# Altium schematic sheet Brushed_Motor_MCU.SchDoc
size A3; SheetNumber: 8; SheetTotal: 8
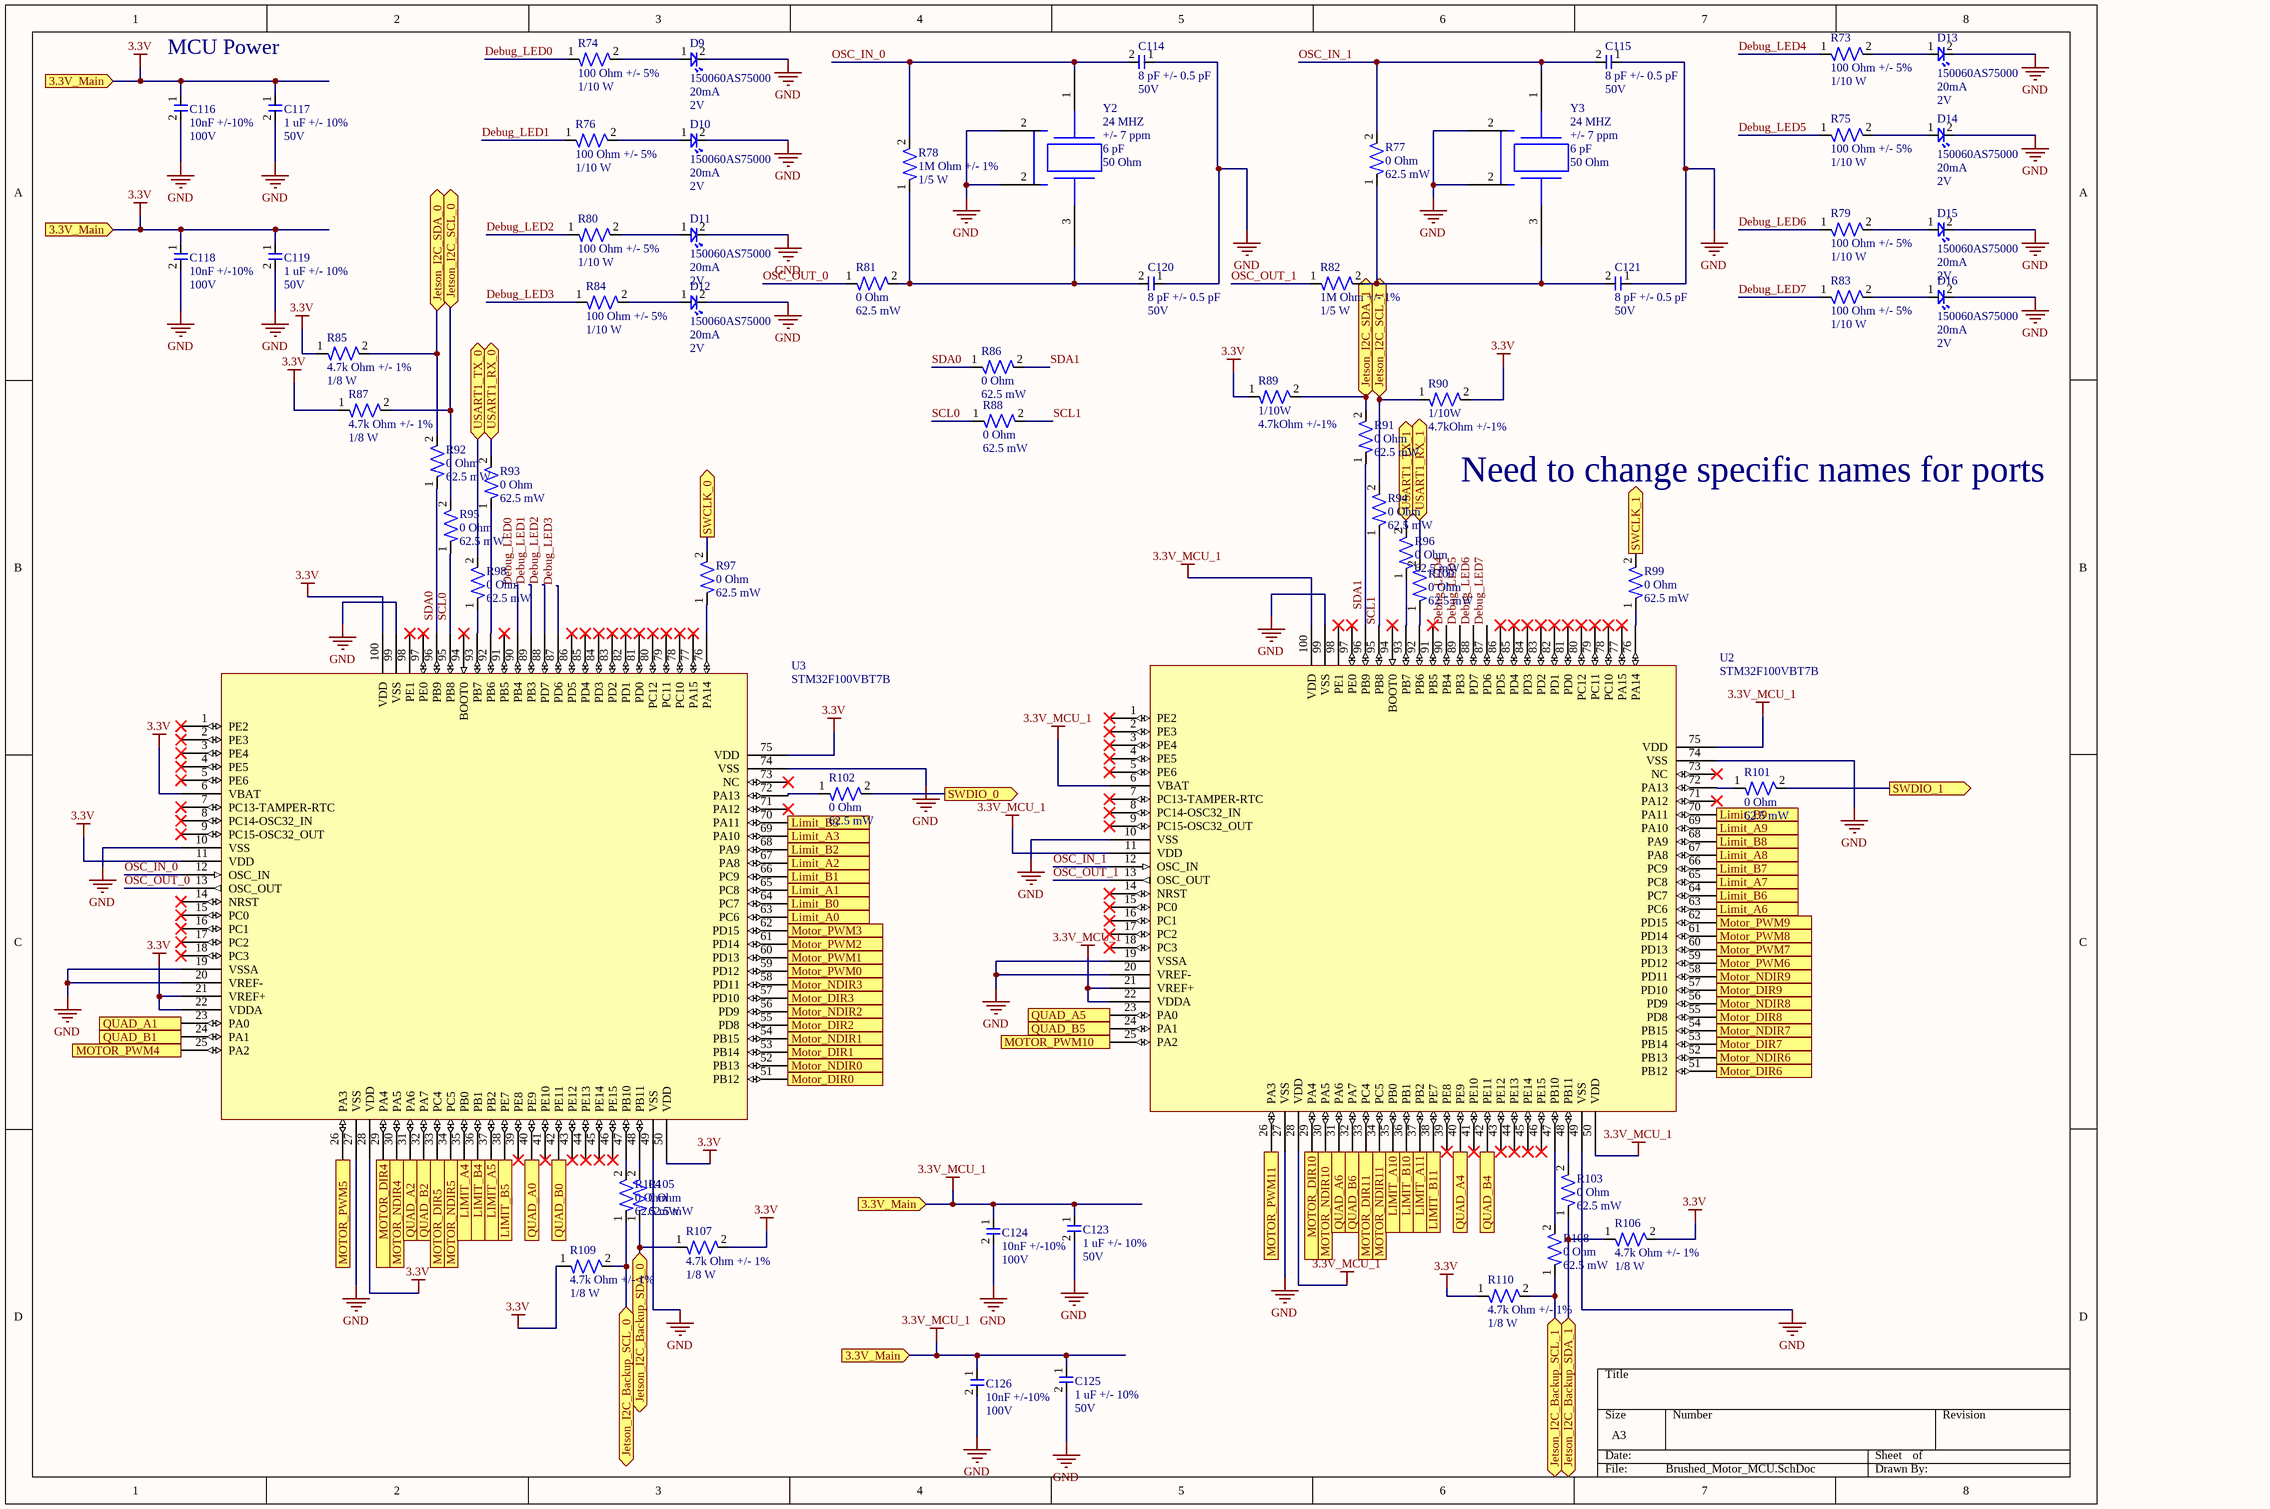
[diagram p0: Brushed_Motor_MCU.SchDoc]

## Parts
C114  Capaitance: 8 pF +/- 0.5 pF  Parameter 2: 50V  [CAP-0402]  (hidden comment: CC0402DRNPO9BN8R0)
C115  Capaitance: 8 pF +/- 0.5 pF  Parameter 2: 50V  [CAP-0402]  (hidden comment: CC0402DRNPO9BN8R0)
C116  Capacitance: 10nF +/-10%  Voltage Rating: 100V  [CAP-0603]  (hidden comment: CC0603KRX7R0BB103)
C117  Cap: 1 uF +/- 10%  Voltage: 50V  [CAP-0805]  (hidden comment: GCM21BR71H105KA03L)
C118  Capacitance: 10nF +/-10%  Voltage Rating: 100V  [CAP-0603]  (hidden comment: CC0603KRX7R0BB103)
C119  Cap: 1 uF +/- 10%  Voltage: 50V  [CAP-0805]  (hidden comment: GCM21BR71H105KA03L)
C120  Capaitance: 8 pF +/- 0.5 pF  Parameter 2: 50V  [CAP-0402]  (hidden comment: CC0402DRNPO9BN8R0)
C121  Capaitance: 8 pF +/- 0.5 pF  Parameter 2: 50V  [CAP-0402]  (hidden comment: CC0402DRNPO9BN8R0)
C123  Cap: 1 uF +/- 10%  Voltage: 50V  [CAP-0805]  (hidden comment: GCM21BR71H105KA03L)
C124  Capacitance: 10nF +/-10%  Voltage Rating: 100V  [CAP-0603]  (hidden comment: CC0603KRX7R0BB103)
C125  Cap: 1 uF +/- 10%  Voltage: 50V  [CAP-0805]  (hidden comment: GCM21BR71H105KA03L)
C126  Capacitance: 10nF +/-10%  Voltage Rating: 100V  [CAP-0603]  (hidden comment: CC0603KRX7R0BB103)
D9  150060AS75000  Current Rating: 20mA  Vf: 2V  [LED-0603]
D10  150060AS75000  Current Rating: 20mA  Vf: 2V  [LED-0603]
D11  150060AS75000  Current Rating: 20mA  Vf: 2V  [LED-0603]
D12  150060AS75000  Current Rating: 20mA  Vf: 2V  [LED-0603]
D13  150060AS75000  Current Rating: 20mA  Vf: 2V  [LED-0603]
D14  150060AS75000  Current Rating: 20mA  Vf: 2V  [LED-0603]
D15  150060AS75000  Current Rating: 20mA  Vf: 2V  [LED-0603]
D16  150060AS75000  Current Rating: 20mA  Vf: 2V  [LED-0603]
R73  Resistance: 100 Ohm +/- 5%  Power: 1/10 W  [RES-0402]  (hidden comment: ERJ2GEJ101X)
R74  Resistance: 100 Ohm +/- 5%  Power: 1/10 W  [RES-0402]  (hidden comment: ERJ2GEJ101X)
R75  Resistance: 100 Ohm +/- 5%  Power: 1/10 W  [RES-0402]  (hidden comment: ERJ2GEJ101X)
R76  Resistance: 100 Ohm +/- 5%  Power: 1/10 W  [RES-0402]  (hidden comment: ERJ2GEJ101X)
R77  Resistance: 0 Ohm  Power: 62.5 mW  [RES-0402]  (hidden comment: RC0402FR-070RL)
R78  Resistance: 1M Ohm +/- 1%  Power: 1/5 W  [RES-0402]  (hidden comment: ERJPA2F1004X)
R79  Resistance: 100 Ohm +/- 5%  Power: 1/10 W  [RES-0402]  (hidden comment: ERJ2GEJ101X)
R80  Resistance: 100 Ohm +/- 5%  Power: 1/10 W  [RES-0402]  (hidden comment: ERJ2GEJ101X)
R81  Resistance: 0 Ohm  Power: 62.5 mW  [RES-0402]  (hidden comment: RC0402FR-070RL)
R82  Resistance: 1M Ohm +/- 1%  Power: 1/5 W  [RES-0402]  (hidden comment: ERJPA2F1004X)
R83  Resistance: 100 Ohm +/- 5%  Power: 1/10 W  [RES-0402]  (hidden comment: ERJ2GEJ101X)
R84  Resistance: 100 Ohm +/- 5%  Power: 1/10 W  [RES-0402]  (hidden comment: ERJ2GEJ101X)
R85  Resistance: 4.7k Ohm +/- 1%  Power: 1/8 W  [RES-0402]  (hidden comment: RC0402FR-7W4K7L)
R86  Resistance: 0 Ohm  Power: 62.5 mW  [RES-0402]  (hidden comment: RC0402FR-070RL)
R87  Resistance: 4.7k Ohm +/- 1%  Power: 1/8 W  [RES-0402]  (hidden comment: RC0402FR-7W4K7L)
R88  Resistance: 0 Ohm  Power: 62.5 mW  [RES-0402]  (hidden comment: RC0402FR-070RL)
R89  Power Rating: 1/10W  Resistance: 4.7kOhm +/-1%  [RES-0603]  (hidden comment: AF0603FR-074K7L)
R90  Power Rating: 1/10W  Resistance: 4.7kOhm +/-1%  [RES-0603]  (hidden comment: AF0603FR-074K7L)
R91  Resistance: 0 Ohm  Power: 62.5 mW  [RES-0402]  (hidden comment: RC0402FR-070RL)
R92  Resistance: 0 Ohm  Power: 62.5 mW  [RES-0402]  (hidden comment: RC0402FR-070RL)
R93  Resistance: 0 Ohm  Power: 62.5 mW  [RES-0402]  (hidden comment: RC0402FR-070RL)
R94  Resistance: 0 Ohm  Power: 62.5 mW  [RES-0402]  (hidden comment: RC0402FR-070RL)
R95  Resistance: 0 Ohm  Power: 62.5 mW  [RES-0402]  (hidden comment: RC0402FR-070RL)
R96  Resistance: 0 Ohm  Power: 62.5 mW  [RES-0402]  (hidden comment: RC0402FR-070RL)
R97  Resistance: 0 Ohm  Power: 62.5 mW  [RES-0402]  (hidden comment: RC0402FR-070RL)
R98  Resistance: 0 Ohm  Power: 62.5 mW  [RES-0402]  (hidden comment: RC0402FR-070RL)
R99  Resistance: 0 Ohm  Power: 62.5 mW  [RES-0402]  (hidden comment: RC0402FR-070RL)
R100  Resistance: 0 Ohm  Power: 62.5 mW  [RES-0402]  (hidden comment: RC0402FR-070RL)
R101  Resistance: 0 Ohm  Power: 62.5 mW  [RES-0402]  (hidden comment: RC0402FR-070RL)
R102  Resistance: 0 Ohm  Power: 62.5 mW  [RES-0402]  (hidden comment: RC0402FR-070RL)
R103  Resistance: 0 Ohm  Power: 62.5 mW  [RES-0402]  (hidden comment: RC0402FR-070RL)
R104  Resistance: 0 Ohm  Power: 62.5 mW  [RES-0402]  (hidden comment: RC0402FR-070RL)
R105  Resistance: 0 Ohm  Power: 62.5 mW  [RES-0402]  (hidden comment: RC0402FR-070RL)
R106  Resistance: 4.7k Ohm +/- 1%  Power: 1/8 W  [RES-0402]  (hidden comment: RC0402FR-7W4K7L)
R107  Resistance: 4.7k Ohm +/- 1%  Power: 1/8 W  [RES-0402]  (hidden comment: RC0402FR-7W4K7L)
R108  Resistance: 0 Ohm  Power: 62.5 mW  [RES-0402]  (hidden comment: RC0402FR-070RL)
R109  Resistance: 4.7k Ohm +/- 1%  Power: 1/8 W  [RES-0402]  (hidden comment: RC0402FR-7W4K7L)
R110  Resistance: 4.7k Ohm +/- 1%  Power: 1/8 W  [RES-0402]  (hidden comment: RC0402FR-7W4K7L)
U2  STM32F100VBT7B  [IC-STM32F100-0001]
U3  STM32F100VBT7B  [IC-STM32F100-0001]
Y2  Frequency: 24 MHZ  Frequency Tolerance: +/- 7 ppm  Load Capacitance: 6 pF  Equavalence Series Resistance: 50 Ohm  [CRYSTAL-4-SMD-0001]  (hidden comment: ECS-240-6-37B-7KM-TR)
Y3  Frequency: 24 MHZ  Frequency Tolerance: +/- 7 ppm  Load Capacitance: 6 pF  Equavalence Series Resistance: 50 Ohm  [CRYSTAL-4-SMD-0001]  (hidden comment: ECS-240-6-37B-7KM-TR)

## Ports
3.3V_Main (in), Jetson_I2C_Backup_SCL_0 (bidir), Jetson_I2C_Backup_SCL_1 (bidir), Jetson_I2C_Backup_SDA_0 (bidir), Jetson_I2C_Backup_SDA_1 (bidir), Jetson_I2C_SCL_0 (bidir), Jetson_I2C_SCL_1 (bidir), Jetson_I2C_SDA_0 (bidir), Jetson_I2C_SDA_1 (bidir), Limit_A0 (out), Limit_A1 (out), Limit_A2 (out), Limit_A3 (out), LIMIT_A4 (out), LIMIT_A5 (out), Limit_A6 (out), Limit_A7 (out), Limit_A8 (out), Limit_A9 (out), LIMIT_A10 (out), LIMIT_A11 (out), Limit_B0 (out), Limit_B1 (out), Limit_B2 (out), Limit_B3 (out), LIMIT_B4 (out), LIMIT_B5 (out), Limit_B6 (out), Limit_B7 (out), Limit_B8 (out), Limit_B9 (out), LIMIT_B10 (out), LIMIT_B11 (out), Motor_DIR0 (out), Motor_DIR1 (out), Motor_DIR2 (out), Motor_DIR3 (out), MOTOR_DIR4 (out), MOTOR_DIR5 (out), Motor_DIR6 (out), Motor_DIR7 (out), Motor_DIR8 (out), Motor_DIR9 (out), MOTOR_DIR10 (out), MOTOR_DIR11 (out), Motor_NDIR0 (out), Motor_NDIR1 (out), Motor_NDIR2 (out), Motor_NDIR3 (out), MOTOR_NDIR4 (out), MOTOR_NDIR5 (out), Motor_NDIR6 (out), Motor_NDIR7 (out), Motor_NDIR8 (out), Motor_NDIR9 (out), MOTOR_NDIR10 (out), MOTOR_NDIR11 (out), Motor_PWM0 (out), Motor_PWM1 (out), Motor_PWM2 (out), Motor_PWM3 (out), MOTOR_PWM4 (out), MOTOR_PWM5 (out), Motor_PWM6 (out), Motor_PWM7 (out), Motor_PWM8 (out), Motor_PWM9 (out), MOTOR_PWM10 (out), MOTOR_PWM11 (out), QUAD_A0 (out), QUAD_A1 (out), QUAD_A2 (out), QUAD_A4 (out), QUAD_A5 (out), QUAD_A6 (out), QUAD_B0 (out), QUAD_B1 (out), QUAD_B2 (out), QUAD_B4 (out), QUAD_B5 (out), QUAD_B6 (out), SWCLK_0 (out), SWCLK_1 (out), SWDIO_0 (out), SWDIO_1 (out), USART1_RX_0 (bidir), USART1_RX_1 (bidir), USART1_TX_0 (bidir), USART1_TX_1 (bidir)

## Nets
3.3V: C116.1 C117.1 C118.1 C119.1 C123.1 C124.1 C125.1 C126.1 R85.1 R87.1 R89.1 R90.2 R106.2 R107.2 R109.1 R110.1 U2.6(VBAT) U2.11(VDD) U2.21(VREF+) U2.22(VDDA) U2.28(VDD) U2.50(VDD) U2.75(VDD) U2.100(VDD) U3.6(VBAT) U3.11(VDD) U3.21(VREF+) U3.22(VDDA) U3.28(VDD) U3.50(VDD) U3.75(VDD) U3.100(VDD) ; port 3.3V_Main  [also labelled 3.3V_MCU_1]
GND: C114.1 C115.1 C116.2 C117.2 C118.2 C119.2 C120.1 C121.1 C123.2 C124.2 C125.2 C126.2 D9.2 D10.2 D11.2 D12.2 D13.2 D14.2 D15.2 D16.2 U2.10(VSS) U2.19(VSSA) U2.20(VREF-) U2.27(VSS) U2.49(VSS) U2.74(VSS) U2.99(VSS) U3.10(VSS) U3.19(VSSA) U3.20(VREF-) U3.27(VSS) U3.49(VSS) U3.74(VSS) U3.99(VSS) Y2.2 Y3.2
Debug_LED0: R74.1 U3.90(PB4)
Debug_LED1: R76.1 U3.89(PB3)
Debug_LED2: R80.1 U3.88(PD7)
Debug_LED3: R84.1 U3.87(PD6)
Debug_LED4: R73.1 U2.90(PB4)
Debug_LED5: R75.1 U2.89(PB3)
Debug_LED6: R79.1 U2.88(PD7)
Debug_LED7: R83.1 U2.87(PD6)
Jetson_I2C_Backup_SCL_0: R104.1 R109.2 ; port Jetson_I2C_Backup_SCL_0
Jetson_I2C_Backup_SCL_1: R108.1 R110.2 ; port Jetson_I2C_Backup_SCL_1
Jetson_I2C_Backup_SDA_0: R105.1 R107.1 ; port Jetson_I2C_Backup_SDA_0
Jetson_I2C_Backup_SDA_1: R103.1 R106.1 ; port Jetson_I2C_Backup_SDA_1
Jetson_I2C_SCL_0: R87.2 R95.2 ; port Jetson_I2C_SCL_0
Jetson_I2C_SCL_1: R90.1 R94.2 ; port Jetson_I2C_SCL_1
Jetson_I2C_SDA_0: R85.2 R92.2 ; port Jetson_I2C_SDA_0
Jetson_I2C_SDA_1: R89.2 R91.2 ; port Jetson_I2C_SDA_1
Limit_A0: U3.63(PC6) ; port Limit_A0
Limit_A1: U3.65(PC8) ; port Limit_A1
Limit_A2: U3.67(PA8) ; port Limit_A2
Limit_A3: U3.69(PA10) ; port Limit_A3
LIMIT_A4: U3.35(PB0) ; port LIMIT_A4
LIMIT_A5: U3.37(PB2) ; port LIMIT_A5
Limit_A6: U2.63(PC6) ; port Limit_A6
Limit_A7: U2.65(PC8) ; port Limit_A7
Limit_A8: U2.67(PA8) ; port Limit_A8
Limit_A9: U2.69(PA10) ; port Limit_A9
LIMIT_A10: U2.35(PB0) ; port LIMIT_A10
LIMIT_A11: U2.37(PB2) ; port LIMIT_A11
Limit_B0: U3.64(PC7) ; port Limit_B0
Limit_B1: U3.66(PC9) ; port Limit_B1
Limit_B2: U3.68(PA9) ; port Limit_B2
Limit_B3: U3.70(PA11) ; port Limit_B3
LIMIT_B4: U3.36(PB1) ; port LIMIT_B4
LIMIT_B5: U3.38(PE7) ; port LIMIT_B5
Limit_B6: U2.64(PC7) ; port Limit_B6
Limit_B7: U2.66(PC9) ; port Limit_B7
Limit_B8: U2.68(PA9) ; port Limit_B8
Limit_B9: U2.70(PA11) ; port Limit_B9
LIMIT_B10: U2.36(PB1) ; port LIMIT_B10
LIMIT_B11: U2.38(PE7) ; port LIMIT_B11
Motor_DIR0: U3.51(PB12) ; port Motor_DIR0
Motor_DIR1: U3.53(PB14) ; port Motor_DIR1
Motor_DIR2: U3.55(PD8) ; port Motor_DIR2
Motor_DIR3: U3.57(PD10) ; port Motor_DIR3
MOTOR_DIR4: U3.29(PA4) ; port MOTOR_DIR4
MOTOR_DIR5: U3.33(PC4) ; port MOTOR_DIR5
Motor_DIR6: U2.51(PB12) ; port Motor_DIR6
Motor_DIR7: U2.53(PB14) ; port Motor_DIR7
Motor_DIR8: U2.55(PD8) ; port Motor_DIR8
Motor_DIR9: U2.57(PD10) ; port Motor_DIR9
MOTOR_DIR10: U2.29(PA4) ; port MOTOR_DIR10
MOTOR_DIR11: U2.33(PC4) ; port MOTOR_DIR11
Motor_NDIR0: U3.52(PB13) ; port Motor_NDIR0
Motor_NDIR1: U3.54(PB15) ; port Motor_NDIR1
Motor_NDIR2: U3.56(PD9) ; port Motor_NDIR2
Motor_NDIR3: U3.58(PD11) ; port Motor_NDIR3
MOTOR_NDIR4: U3.30(PA5) ; port MOTOR_NDIR4
MOTOR_NDIR5: U3.34(PC5) ; port MOTOR_NDIR5
Motor_NDIR6: U2.52(PB13) ; port Motor_NDIR6
Motor_NDIR7: U2.54(PB15) ; port Motor_NDIR7
Motor_NDIR8: U2.56(PD9) ; port Motor_NDIR8
Motor_NDIR9: U2.58(PD11) ; port Motor_NDIR9
MOTOR_NDIR10: U2.30(PA5) ; port MOTOR_NDIR10
MOTOR_NDIR11: U2.34(PC5) ; port MOTOR_NDIR11
Motor_PWM0: U3.59(PD12) ; port Motor_PWM0
Motor_PWM1: U3.60(PD13) ; port Motor_PWM1
Motor_PWM2: U3.61(PD14) ; port Motor_PWM2
Motor_PWM3: U3.62(PD15) ; port Motor_PWM3
MOTOR_PWM4: U3.25(PA2) ; port MOTOR_PWM4
MOTOR_PWM5: U3.26(PA3) ; port MOTOR_PWM5
Motor_PWM6: U2.59(PD12) ; port Motor_PWM6
Motor_PWM7: U2.60(PD13) ; port Motor_PWM7
Motor_PWM8: U2.61(PD14) ; port Motor_PWM8
Motor_PWM9: U2.62(PD15) ; port Motor_PWM9
MOTOR_PWM10: U2.25(PA2) ; port MOTOR_PWM10
MOTOR_PWM11: U2.26(PA3) ; port MOTOR_PWM11
OSC_IN_0: C114.2 R78.2 U3.12(OSC_IN) Y2.1
OSC_IN_1: C115.2 R77.2 U2.12(OSC_IN) Y3.1
OSC_OUT_0: R81.1 U3.13(OSC_OUT)
OSC_OUT_1: R82.1 U2.13(OSC_OUT)
QUAD_A0: U3.40(PE9) ; port QUAD_A0
QUAD_A1: U3.23(PA0) ; port QUAD_A1
QUAD_A2: U3.31(PA6) ; port QUAD_A2
QUAD_A4: U2.40(PE9) ; port QUAD_A4
QUAD_A5: U2.23(PA0) ; port QUAD_A5
QUAD_A6: U2.31(PA6) ; port QUAD_A6
QUAD_B0: U3.42(PE11) ; port QUAD_B0
QUAD_B1: U3.24(PA1) ; port QUAD_B1
QUAD_B2: U3.32(PA7) ; port QUAD_B2
QUAD_B4: U2.42(PE11) ; port QUAD_B4
QUAD_B5: U2.24(PA1) ; port QUAD_B5
QUAD_B6: U2.32(PA7) ; port QUAD_B6
SCL0: R88.1 R95.1 U3.95(PB8)
SCL1: R88.2 R94.1 U2.95(PB8)
SDA0: R86.1 R92.1 U3.96(PB9)
SDA1: R86.2 R91.1 U2.96(PB9)
SWCLK_0: R97.2 ; port SWCLK_0
SWCLK_1: R99.2 ; port SWCLK_1
SWDIO_0: R102.2 ; port SWDIO_0
SWDIO_1: R101.2 ; port SWDIO_1
USART1_RX_0: R93.2 ; port USART1_RX_0
USART1_RX_1: R100.2 ; port USART1_RX_1
USART1_TX_0: R98.2 ; port USART1_TX_0
USART1_TX_1: R96.2 ; port USART1_TX_1
NetC120_2: C120.2 R78.1 R81.2 Y2.3
NetC121_2: C121.2 R77.1 R82.2 Y3.3
NetD9_1: D9.1 R74.2
NetD10_1: D10.1 R76.2
NetD11_1: D11.1 R80.2
NetD12_1: D12.1 R84.2
NetD13_1: D13.1 R73.2
NetD14_1: D14.1 R75.2
NetD15_1: D15.1 R79.2
NetD16_1: D16.1 R83.2
NetR93_1: R93.1 U3.92(PB6)
NetR96_1: R96.1 U2.93(PB7)
NetR97_1: R97.1 U3.76(PA14)
NetR98_1: R98.1 U3.93(PB7)
NetR99_1: R99.1 U2.76(PA14)
NetR100_1: R100.1 U2.92(PB6)
NetR101_1: R101.1 U2.72(PA13)
NetR102_1: R102.1 U3.72(PA13)
NetR103_2: R103.2 U2.48(PB11)
NetR104_2: R104.2 U3.47(PB10)
NetR105_2: R105.2 U3.48(PB11)
NetR108_2: R108.2 U2.47(PB10)

Not connected (* = marked no-connect by the designer): U2 1(PE2)* 2(PE3)* 3(PE4)* 4(PE5)* 5(PE6)* 7(PC13-TAMPER-RTC)* 8(PC14-OSC32_IN)* 9(PC15-OSC32_OUT)* 14(NRST)* 15(PC0)* 16(PC1)* 17(PC2)* 18(PC3)* 39(PE8)* 41(PE10)* 43(PE12)* 44(PE13)* 45(PE14)* 46(PE15)* 71(PA12)* 73(NC)* 77(PA15)* 78(PC10)* 79(PC11)* 80(PC12)* 81(PD0)* 82(PD1)* 83(PD2)* 84(PD3)* 85(PD4)* 86(PD5)* 91(PB5)* 94(BOOT0)* 97(PE0)* 98(PE1)*; U3 1(PE2)* 2(PE3)* 3(PE4)* 4(PE5)* 5(PE6)* 7(PC13-TAMPER-RTC)* 8(PC14-OSC32_IN)* 9(PC15-OSC32_OUT)* 14(NRST)* 15(PC0)* 16(PC1)* 17(PC2)* 18(PC3)* 39(PE8)* 41(PE10)* 43(PE12)* 44(PE13)* 45(PE14)* 46(PE15)* 71(PA12)* 73(NC)* 77(PA15)* 78(PC10)* 79(PC11)* 80(PC12)* 81(PD0)* 82(PD1)* 83(PD2)* 84(PD3)* 85(PD4)* 86(PD5)* 91(PB5)* 94(BOOT0)* 97(PE0)* 98(PE1)*

## Notes on the sheet
- MCU Power
- Need to change specific names for ports

## Library data of the parts
C114 C115 C120 C121 = CAP-8P-0002-JLC: 50V 8pF NP0 ±0.5pF 0402 Multilayer Ceramic Capacitors MLCC - SMD/SMT ROHS; assembled: yes; JLC part number: C327227
C116 C118 C124 C126 = CAP-10N-0003-JLC: 100V 10nF X7R ±10% 0603 Multilayer Ceramic Capacitors MLCC - SMD/SMT ROHS; Manufacturer: Yageo; Assembled?: yes; Manufacturer Part Number: CC0603KRX7R0BB103; Temperature Coefficient: X7R; Package Size: 0603; JLC Part Number: C107059
C117 C119 C123 C125 = CAP-1U-0003-JLC: 50V 1uF X7R ±10% 0805 Multilayer Ceramic Capacitors MLCC - SMD/SMT ROHS; assembled?: yes; JLC Part Number: C126592
D9-D16 = LED_Amber_0001: CAP CER 0.1UF 100V X7R 0603; Manufacturer: Wurth Electronik; Assembled?: no; Color: Amber; Manufacturer Part Number: 150060AS75000; Package Size: 0603
R73-R76 R79 R80 R83 R84 = RES-100-0003-JLC: 100mW Thick Film Resistors ±5% ±200ppm/℃ -55℃~+155℃ 100Ω 0402  Chip Resistor - Surface Mount ROHS; assembled?: yes; JLC part number: C412972
R77 R81 R86 R88 R91-R105 R108 = RES-0-0002-JLC: 62.5mW Thick Film Resistors 50V -55℃~+155℃ 0Ω 0402 Chip Resistor - Surface Mount ROHS; assembled?: yes; JLC part number: C106231
R78 R82 = RES-1M-0002-JLC: 1/5W ±100ppm/℃ ±1% -55℃~+155℃ 1MΩ 0402 Chip Resistor - Surface Mount ROHS; assembled?: yes; JLC part number: C427259
R85 R87 R106 R107 R109 R110 = RES-4.7K-0003-JLC: 125mW Thick Film Resistors 50V ±1% ±200ppm/℃ -55℃~+155℃ 4.7kΩ 0402  Chip Resistor - Surface Mount ROHS; assembled?: yes; JLC part number: C606173
R89 R90 = RES-4.7K-0002: RES SMD 4.7K OHM 1% 1/10W 0603; Manufacturer: YAGEO; Assembled?: no; Manufacturer Part Number: AF0603FR-074K7L; Package Size: 0603
U2 U3 = IC-STM32F100-0001: ARM® Cortex®-M3 STM32F1 Microcontroller IC 32-Bit Single-Core 24MHz 128KB (128K x 8) FLASH 100-LQFP (14x14); VCC: 2 ~ 3.6V; Manufacturer Part Number: STM32F100VBT7B; Package Size: 100-LQFP
Y2 Y3 = CRYSTAL-24MHz-0001: 24 MHz ±7ppm Crystal 6pF 50 Ohms 4-SMD, No Lead; Manufacturer: ECS Inc.; Manufacturer Part Number: ECS-240-6-37B-7KM-TR; Package Size: 4-SMD